# EasyEDA Pro project voltage_cutoff.eprj

# Schematic Schematic1
Board Name: Board1; Create Date: 2026-04-07; Page Name: P1; Project Name: voltage_cutoff; Schematic Name: Schematic1; Update Date: 2026-04-12; Company: EasyEDA.com; Page Size: A4; Version: V1.0
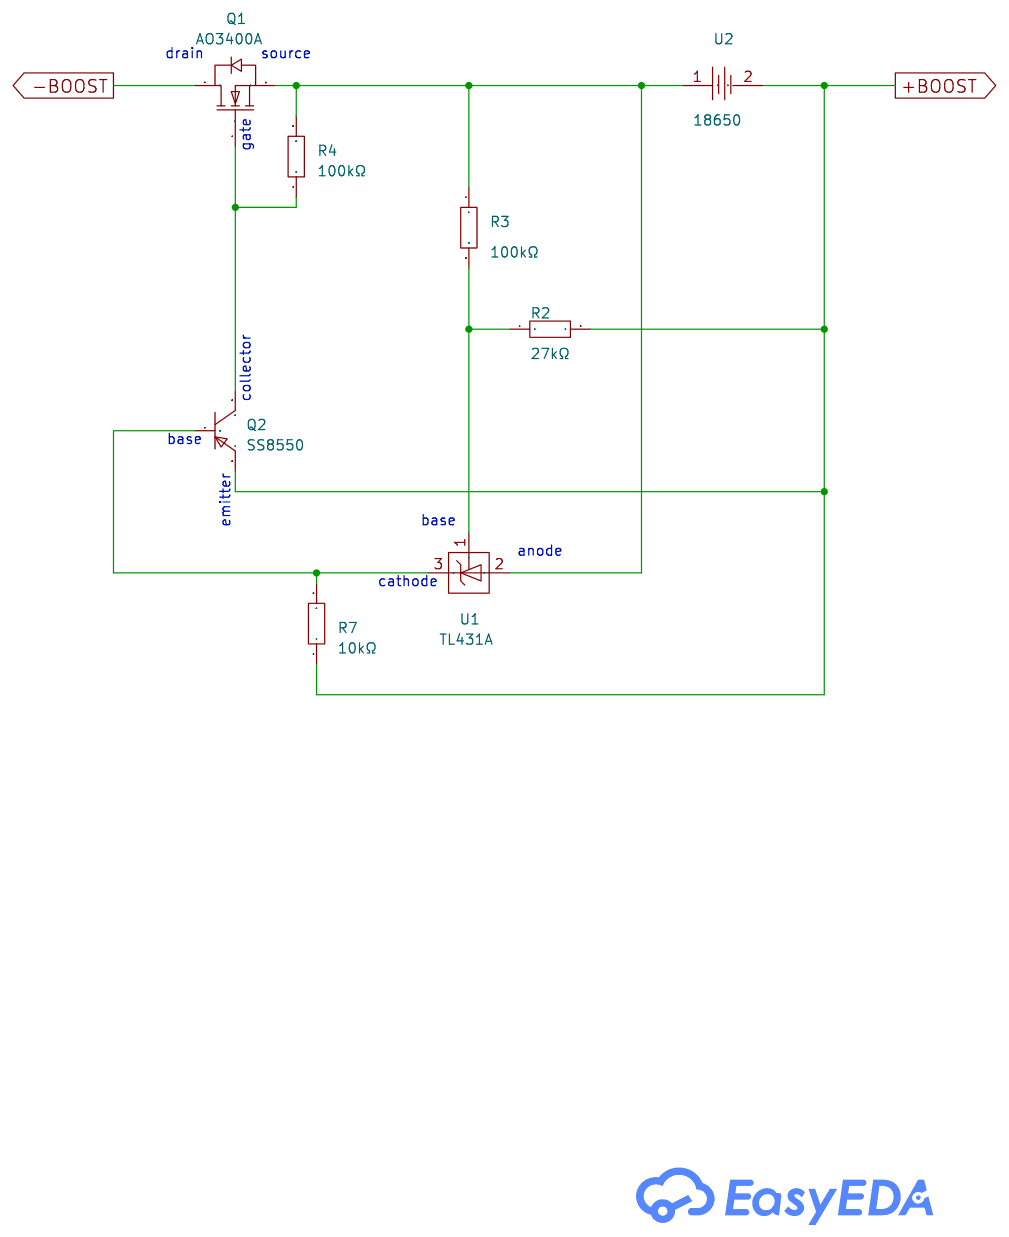
[diagram p0: schematic sheet]

## Parts
Q1  AO3400A  [SOT-23-3_L2.9-W1.3-P1.90-LS2.4-BR]
Q2  SS8550  [SOT-23-3_L2.9-W1.3-P1.90-LS2.4-BR]
R2  27kΩ  [R0805]
R3  100kΩ  [R0805]
R4  100kΩ  [R0805]
R7  10kΩ  [R0805]
U1  TL431A  [SOT-23-3_L2.9-W1.3-P1.90-LS2.4-BR]
U2  18650  [BAT-TH_18650-C9900004923]

## Library data of the parts
Q1 = AO3400A_C49195711: LCSC Part Name: N沟道 耐压:30V 电流:5.8A; Supplier Part: C49195711; Manufacturer: YONGYUTAI(永裕泰); Supplier Footprint: SOT-23; JLCPCB Part Class: Extended Part; Datasheet: https://item.szlcsc.com/datasheet/AO3400A/51597059.html; Supplier: LCSC; Drain to Source Voltage: 30V; Current - Continuous Drain(Id): 5.8A; RDS(on): 19mΩ@10V; Pd - Power Dissipation: 1.36W; Gate Threshold Voltage (Vgs(th)): 900mV@250uA; Gate Charge(Qg): 7.5nC@4.5V; Input Capacitance(Ciss): 702pF; Reverse Transfer Capacitance (Crss@Vds): 52pF; Operating Temperature: -55℃~+150℃; Type: N-Channel; Output Capacitance(Coss): 66pF
Q2 = SS8550 Y2(RANGE:200-350): LCSC Part Name: PNP 电流:1.5A 耐压:25V hfe=200~350; Supplier Part: C8542; Manufacturer: CJ(江苏长电/长晶); Supplier Footprint: SOT-23; JLCPCB Part Class: Basic Part; Datasheet: https://atta.szlcsc.com/upload/public/pdf/source/20140809/1457707214734.pdf; Supplier: LCSC; DC Current Gain (hFE@Ic,Vce): 200@100mA,1V; Transition Frequency (fT): 100MHz; Collector Cut-Off Current (Icbo): 100nA; Collector-Emitter Saturation Voltage (VCE(sat)@Ic,Ib): 500mV@800mA,80mA; Operating Temperature: -55℃~+150℃
R2 = RMC08053.3K1%N: Type:Thick Film Resistor Resistance:3.3kΩ Tolerance:±1% Tolerance:±1% Power(Watts):125mW Voltage-Supply(Max):150V Temperature Coefficient:±100ppm/℃ Temperature Coefficient:±100ppm/℃ Operating Temperature:-55℃~+155℃ Operating Temperature:-55℃~+155℃; LCSC Part Name: 3.3kΩ ±1% 125mW; Supplier Part: C269541; Manufacturer: Tyohm(幸亚电阻); Supplier Footprint: 0805; JLCPCB Part Class: Extended Part; Datasheet: https://item.szlcsc.com/datasheet/RMC08053.3K1%2525N/258981.html; Supplier: LCSC; Type: Thick Film Resistor; Tolerance: ±1%; Power(Watts): 125mW; Voltage-Supply(Max): 150V; Temperature Coefficient: ±100ppm/℃; Operating Temperature: -55℃~+155℃
R3 = SCR0805J12K: Type:Thick Film Resistor Resistance:12kΩ Tolerance:±5% Tolerance:±5% Power(Watts):125mW Voltage-Supply(Max):150V Temperature Coefficient:±200ppm/℃ Temperature Coefficient:±200ppm/℃ Operating Temperature:-55℃~+155℃ Operating Temperature:-55℃~+155℃; LCSC Part Name: 厚膜电阻 12kΩ ±5% 125mW; Supplier Part: C3017860; Manufacturer: VO(翔胜); Supplier Footprint: 0805; JLCPCB Part Class: Extended Part; Datasheet: https://item.szlcsc.com/datasheet/SCR0805J12K/3530384.html; Supplier: LCSC; Type: Thick Film Resistor; Tolerance: ±5%; Power(Watts): 125mW; Voltage-Supply(Max): 150V; Temperature Coefficient: ±200ppm/℃; Operating Temperature: -55℃~+155℃
R4 = SCR0805J100K: Type:Thick Film Resistors Resistance: Tolerance:±5% Tolerance:±5% Power(Watts): Overload Voltage (Max): Operating Temperature Range:-55℃~+155℃ Operating Temperature Range:-55℃~+155℃; LCSC Part Name: 厚膜电阻 100kΩ ±5% 125mW; Supplier Part: C3017875; Manufacturer: VO(翔胜); Supplier Footprint: 0805; JLCPCB Part Class: Extended Part; Datasheet: https://atta.szlcsc.com/upload/public/pdf/source/20220513/247AF9639BA21CF93567DC289CCC6A22.pdf; Supplier: LCSC; Type: Thick Film Resistors; Tolerance: ±5%; Operating Temperature Range: -55℃~+155℃
R7 = SCR0805F10K: Type:Thick Film Resistor Resistance:10kΩ Tolerance:±1% Tolerance:±1% Power(Watts):125mW Voltage-Supply(Max):150V Operating Temperature:-55℃~+155℃ Operating Temperature:-55℃~+155℃; LCSC Part Name: 厚膜电阻 10kΩ ±1% 125mW; Supplier Part: C3016734; Manufacturer: VO(翔胜); Supplier Footprint: 0805; JLCPCB Part Class: Extended Part; Datasheet: https://item.szlcsc.com/datasheet/SCR0805F10K/3529188.html; Supplier: LCSC; Type: Thick Film Resistor; Tolerance: ±1%; Power(Watts): 125mW; Voltage-Supply(Max): 150V; Operating Temperature: -55℃~+155℃
U1 = TL431A_C5182287: Output Type:Adjustable Voltage - Supply:2.495V~36V Voltage - Supply:2.495V~36V Output Voltage:2.495V~36V Output Voltage:2.495V~36V Output Current:100mA Tolerance:±0.5% Tolerance:±0.5% Temperature Coefficient:- Reference Type:- Quiescent Current:- Minimum; LCSC Part Name: 2.495V~36V; Supplier Part: C5182287; Manufacturer: JUXING(钜兴); Supplier Footprint: SOT-23; JLCPCB Part Class: Extended Part; Datasheet: https://item.szlcsc.com/datasheet/TL431A/5842800.html; Supplier: LCSC; Output Type: Adjustable; Voltage - Supply: 2.495V~36V; Output Voltage: 2.495V~36V; Output Current: 100mA; Tolerance: ±0.5%; Minimum Cathode Current for Regulation: 450uA; Operating Temperature: 0℃~+70℃
U2 = 18650 电池盒 插件 1节: Supplier Part: C9900004923; Supplier Footprint: BAT_TH_2P-L77.7-W20.9-P55.61; Supplier: LCSC

## Nets
+BOOST: Q2.2(E) R2.2 R7.1 U2.2
-BOOST: Q1.2(D)
Net-(Q1-1): Q1.1(G) Q2.3(C) R4.1
Net-(Q1-3): Q1.3(S) R3.1 R4.2 U1.2(A) U2.1
Net-(Q2-1): Q2.1(B) R7.2 U1.3(C)
Net-(R2-1): R2.1 R3.2 U1.1(R)

## Notes on the sheet
- drain
- source
- gate
- collector
- base
- emitter
- base
- anode
- cathode

# Schematic Schematic2
Create Date: 2026-05-19; Page Name: P1; Project Name: voltage_cutoff; Schematic Name: Schematic2; Update Date: 2026-05-18; Company: EasyEDA.com; Page Size: A4; Version: V1.0
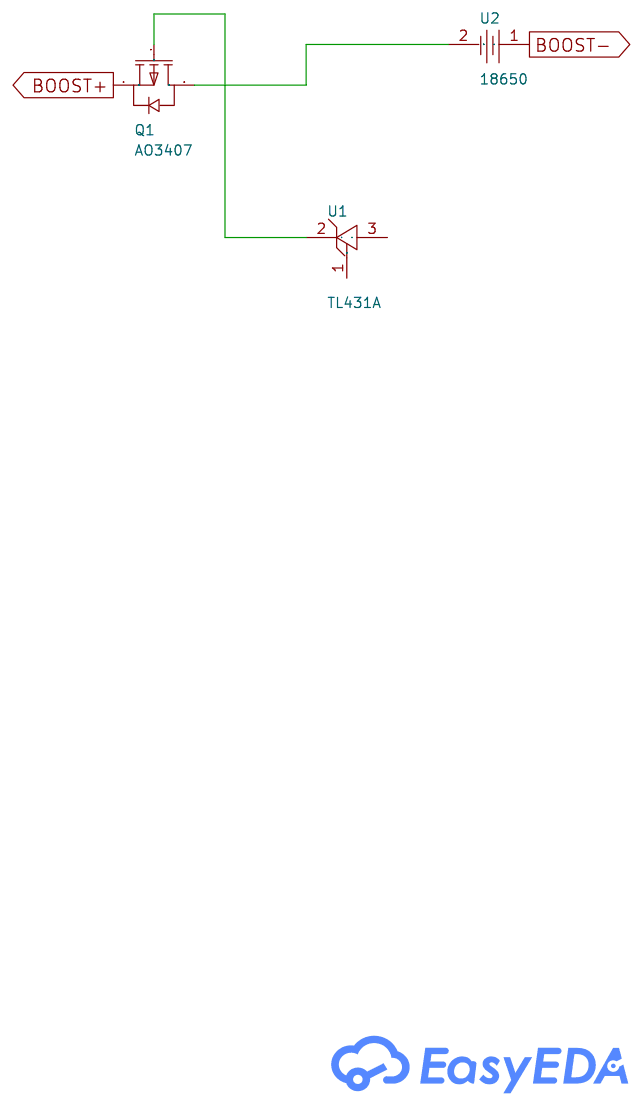
[diagram p1: schematic sheet]

## Parts
Q1  AO3407  [SOT-23-3_L2.9-W1.6-P1.90-LS2.8-BR]
U1  TL431A  [SOT-23-3_L2.9-W1.3-P1.90-LS2.4-BR]
U2  18650  [BAT-TH_18650-C9900004923]

## Library data of the parts
Q1 = AO3407: LCSC Part Name: 1个P沟道 耐压:30V 电流:4.1A; Supplier Part: C727158; Manufacturer: TWGMC(迪嘉); Supplier Footprint: SOT-23; JLCPCB Part Class: Extended Part; Datasheet: https://item.szlcsc.com/datasheet/AO3407/774263.html; Supplier: LCSC; Number: 1 P-Channel; Drain to Source Voltage: 30V; Current - Continuous Drain(Id): 4.1A; RDS(on): 87mΩ@4.5V,3A; Pd - Power Dissipation: 350mW; Gate Threshold Voltage (Vgs(th)): 3V; Input Capacitance(Ciss): 700pF; Reverse Transfer Capacitance (Crss@Vds): 75pF; Operating Temperature: -40℃~+150℃; Type: P-Channel; Output Capacitance(Coss): 120pF
U1 = TL431A: LCSC Part Name: 37V 并联; Supplier Part: C411753; Manufacturer: PJSEMI(平晶微); Supplier Footprint: SOT-23; JLCPCB Part Class: Extended Part; Datasheet: https://item.szlcsc.com/datasheet/TL431A/403126.html; Supplier: LCSC; Output Type: Adjustable; Voltage - Supply: 37V; Output Voltage: 2.495V~36V; Output Current: 100mA; Reference Type: Parallel; Minimum Cathode Current for Regulation: 1mA; Operating Temperature: -40℃~+85℃
U2 = 18650 电池盒 插件 1节: Supplier Part: C9900004923; Supplier Footprint: BAT_TH_2P-L77.7-W20.9-P55.61; Supplier: LCSC

## Nets
BOOST+: Q1.2(S)
BOOST-: U2.1
Net-(Q1-1): Q1.1(G) U1.2(K)
Net-(Q1-3): Q1.3(D) U2.2

Not connected (* = marked no-connect by the designer): U1 1(R) 3(A)
